# Altium schematic sheet Digital_In.SchDoc
size 420 x 297 mm; DocumentNumber: САНП.*; _Razrabotal: {Разработал}; _Proveril: {Проверил}; _TKontr: {Т.контр}; _NKontr: {Н.контр}; _Utverdil: {Утвердил}
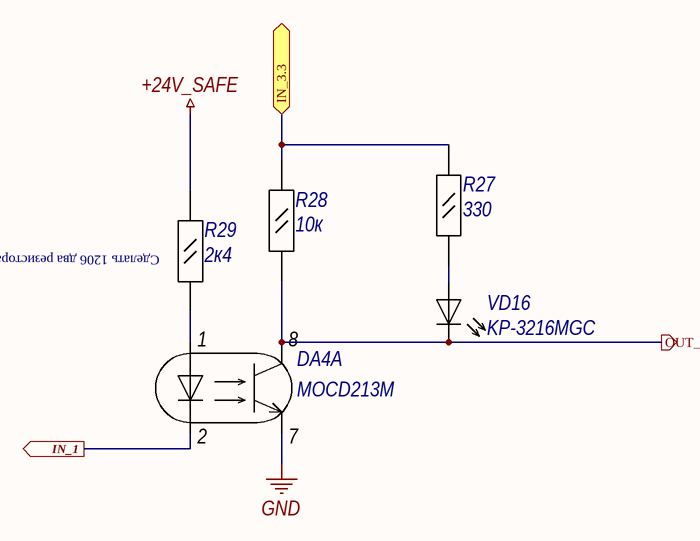
[diagram p0: Digital_In.SchDoc]

## Parts
DA4  MOCD213M  [SO-8]  (part A of 2)
R27  330  [0805]
R28  10к  [0805]
R29  2к4  [0805]
VD16  KP-3216MGC  [LED3216]

## Ports
IN_1, IN_3.3, OUT_1

## Nets
+24V_SAFE: R29.2
GND: DA4.7(E1)
IN_1: DA4.2(CATHODE1) ; port IN_1
IN_3.3: R27.1 R28.2 ; port IN_3.3
OUT_1: DA4.8(C1) R28.1 VD16.2(K) ; port OUT_1
NetDA4_1: DA4.1(ANODE1) R29.1
NetR27_2: R27.2 VD16.1(A)

## Notes on the sheet
- (near R29) Сделать 1206 два резистора последовательно вместо этого
- Перв. примен.
- Справ. №
- Подп. и дата
- Инв.№ дубл.
- Взам. инв.№
- Инв. № подп.
- Лист
- Изм.
- № докум.
- Подпись
- Дата
- Копировал
- Формат      А3

## Library data of the parts
DA4 = MOCD213M: Оптопара 2 канала; Manufacturer: Fairchild; PackageName: SO-8; ComponentType: Микросхема; ComponentName: MOCD213M
R27-R29 = RC0805JR: Резистор общего назначения 5%; Manufacturer: YAGEO; PackageName: 0805; ComponentType: Резистор; Accuracy: 5%; ComponentName: RC0805JR
  R27: Value: 330
  R28: Value: 10к
  R29: Value: 2к4
VD16 = KP-3216: Светодиод; Manufacturer: Kingbright; ComponentType: Светодиод; ComponentName: KP-3216MGC